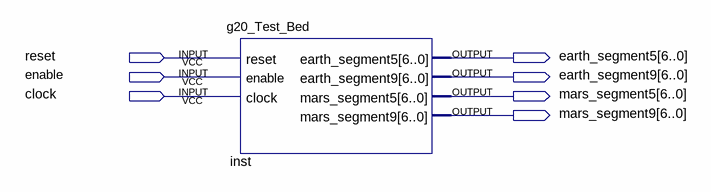
[diagram p0: schematic sheet]
// Quartus schematic Test_Bed.bdf as structural Verilog: 1 symbols, 7 pins
module Test_Bed (
  input  reset,
  input  enable,
  input  clock,
  output [6:0] earth_segment5,
  output [6:0] earth_segment9,
  output [6:0] mars_segment5,
  output [6:0] mars_segment9
);

  g20_Test_Bed inst (
    .reset(reset), .enable(enable), .clock(clock), .earth_segment5(earth_segment5),
    .earth_segment9(earth_segment9), .mars_segment5(mars_segment5), .mars_segment9(mars_segment9));
endmodule
